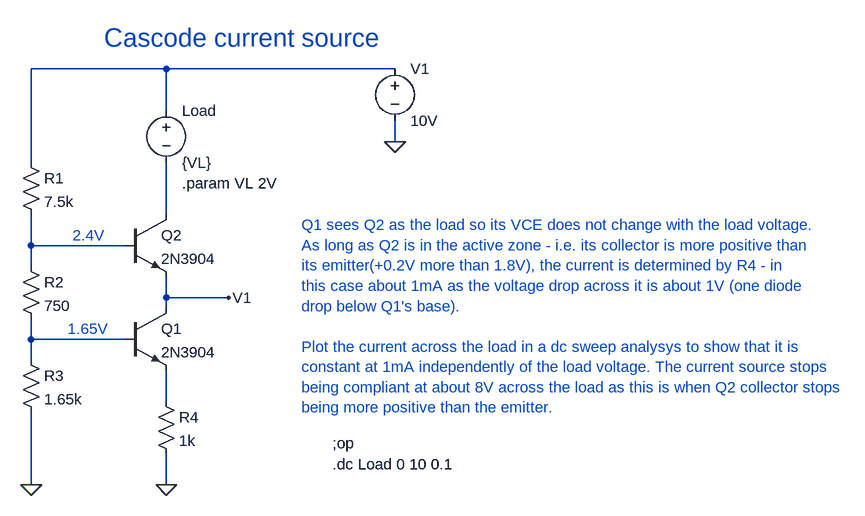
[diagram p0: schematic Figure2.24.asc]
Figure2.24.asc, the LTspice schematic file:
Version 4
SHEET 1 1468 680
WIRE 256 -112 48 -112
WIRE 608 -112 256 -112
WIRE 256 -48 256 -112
WIRE 608 0 608 -32
WIRE 48 32 48 -112
WIRE 256 112 256 32
WIRE 48 160 48 112
WIRE 192 160 48 160
WIRE 48 192 48 160
WIRE 256 240 256 208
WIRE 352 240 256 240
WIRE 256 256 256 240
WIRE 48 304 48 272
WIRE 192 304 48 304
WIRE 48 336 48 304
WIRE 256 400 256 352
WIRE 48 528 48 416
WIRE 256 528 256 480
FLAG 48 528 0
FLAG 256 528 0
FLAG 608 0 0
FLAG 352 240 V1
SYMBOL res 32 16 R0
SYMATTR InstName R1
SYMATTR Value 7.5k
SYMBOL res 32 176 R0
SYMATTR InstName R2
SYMATTR Value 750
SYMBOL res 32 320 R0
SYMATTR InstName R3
SYMATTR Value 1.65k
SYMBOL npn 192 112 R0
SYMATTR InstName Q2
SYMATTR Value 2N3904
SYMBOL npn 192 256 R0
SYMATTR InstName Q1
SYMATTR Value 2N3904
SYMBOL res 240 384 R0
SYMATTR InstName R4
SYMATTR Value 1k
SYMBOL voltage 608 -128 R0
WINDOW 123 0 0 Left 0
WINDOW 39 0 0 Left 0
SYMATTR InstName V1
SYMATTR Value 10V
SYMBOL voltage 256 -64 R0
SYMATTR InstName Load
SYMATTR Value {VL}
TEXT 280 64 Left 2 !.param VL 2V
TEXT 512 464 Left 2 !;op
TEXT 512 496 Left 2 !.dc Load 0 10 0.1
TEXT 160 -160 Left 4 ;Cascode current source
TEXT 464 128 Left 2 ;Q1 sees Q2 as the load so its VCE does not change with the load voltage.\nAs long as Q2 is in the active zone - i.e. its collector is more positive than \nits emitter(+0.2V more than 1.8V), the current is determined by R4 - in \nthis case about 1mA as the voltage drop across it is about 1V (one diode \ndrop below Q1's base).\n \nPlot the current across the load in a dc sweep analysys to show that it is\nconstant at 1mA independently of the load voltage. The current source stops\nbeing compliant at about 8V across the load as this is when Q2 collector stops\nbeing more positive than the emitter.
TEXT 104 288 Left 2 ;1.65V
TEXT 112 144 Left 2 ;2.4V

The netlist it stands for:
* Figure2.24.asc
R1 N001 N003 7.5k
R2 N003 N004 750
R3 N004 0 1.65k
Q2 N002 N003 V1 0 2N3904
Q1 V1 N004 N005 0 2N3904
R4 N005 0 1k
V1 N001 0 10V
V§Load N001 N002 {VL}
.model NPN NPN
.model PNP PNP
.lib standard.bjt
.param VL 2V
;op
.dc Load 0 10 0.1
* Cascode current source
* Q1 sees Q2 as the load so its VCE does not change with the load voltage.
* As long as Q2 is in the active zone - i.e. its collector is more positive than
* its emitter(+0.2V more than 1.8V), the current is determined by R4 - in
* this case about 1mA as the voltage drop across it is about 1V (one diode
* drop below Q1's base).
* Plot the current across the load in a dc sweep analysys to show that it is
* constant at 1mA independently of the load voltage. The current source stops
* being compliant at about 8V across the load as this is when Q2 collector stops
* being more positive than the emitter.
* 1.65V
* 2.4V
.backanno
.end